# Altium schematic sheet Sheet2.SchDoc
size 839 x 594 mm; SheetNumber: 2; SheetTotal: 3
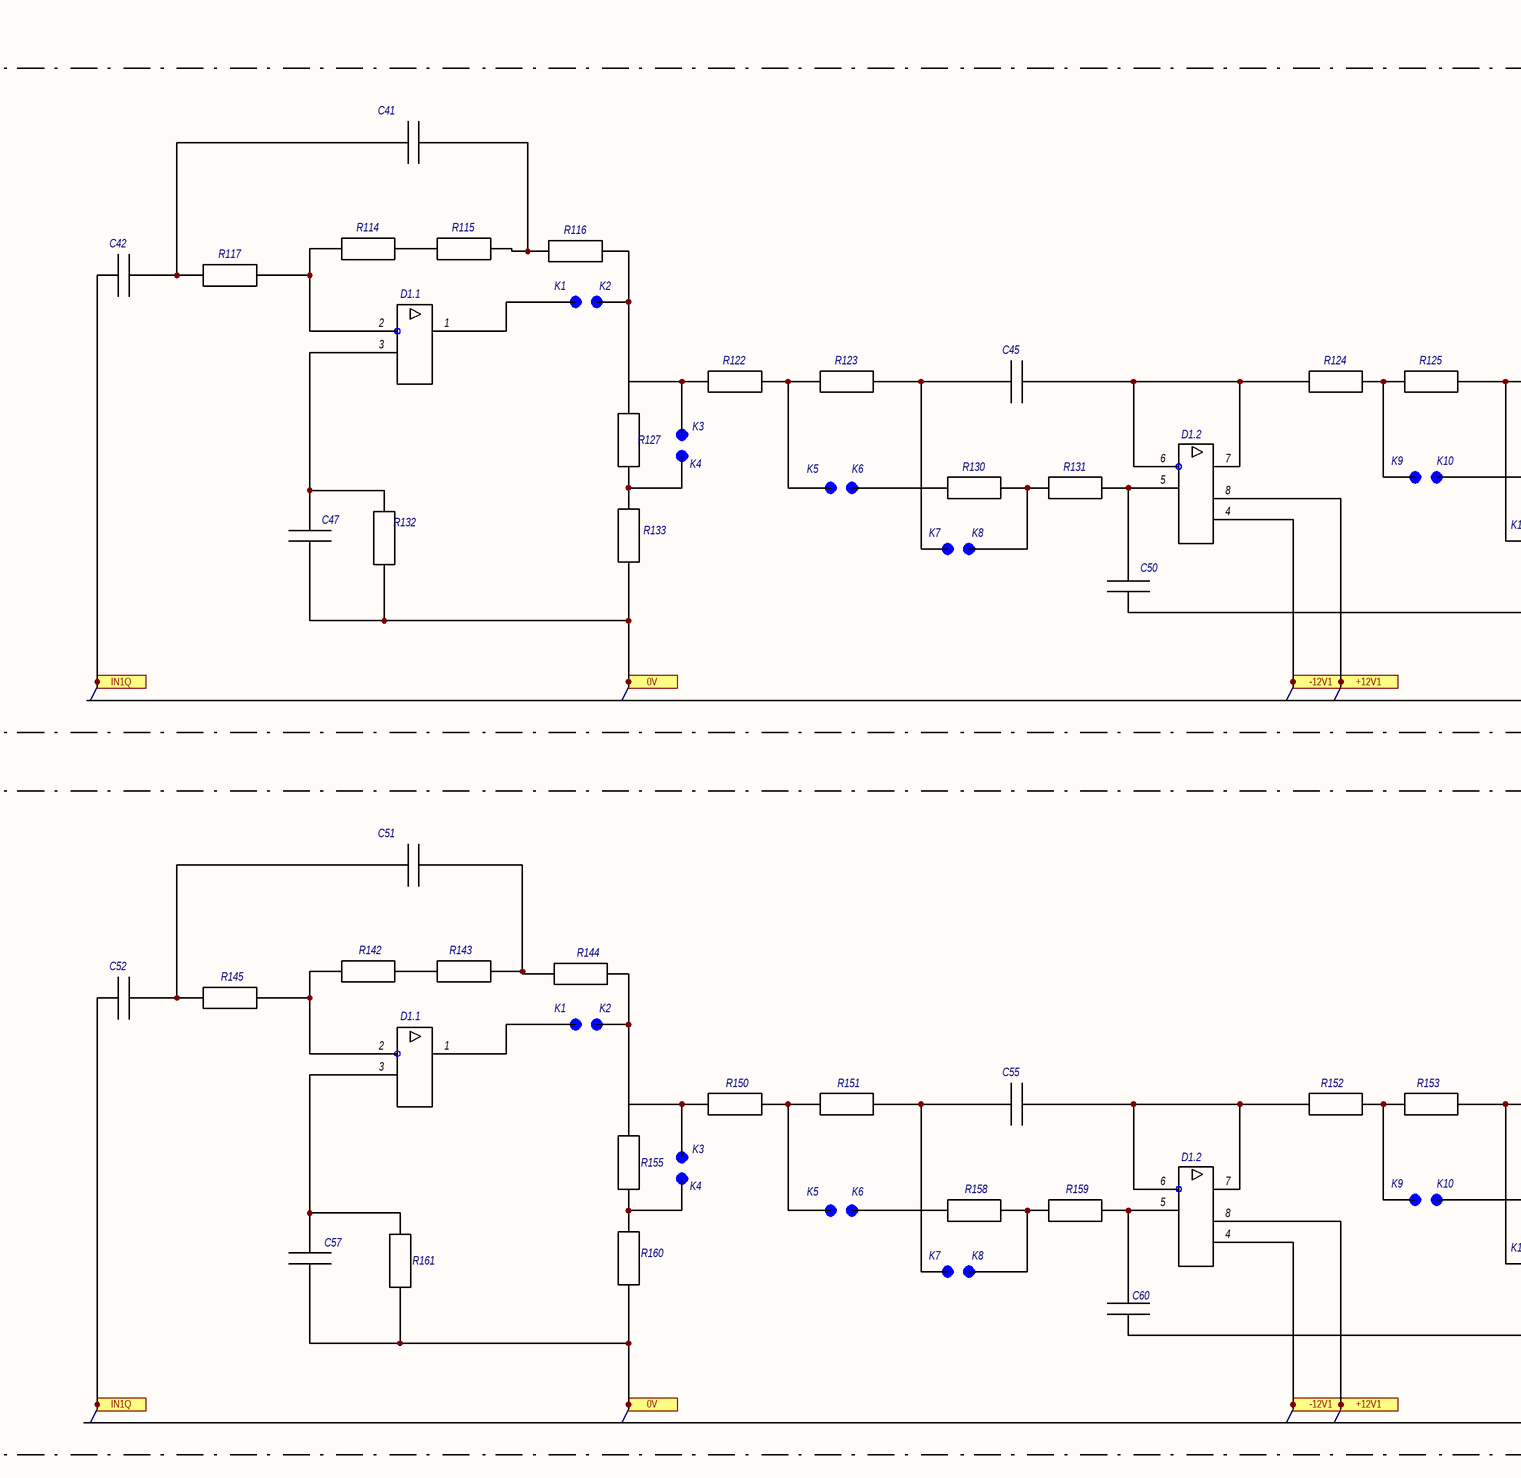
[diagram p0: Sheet2.SchDoc, top left]
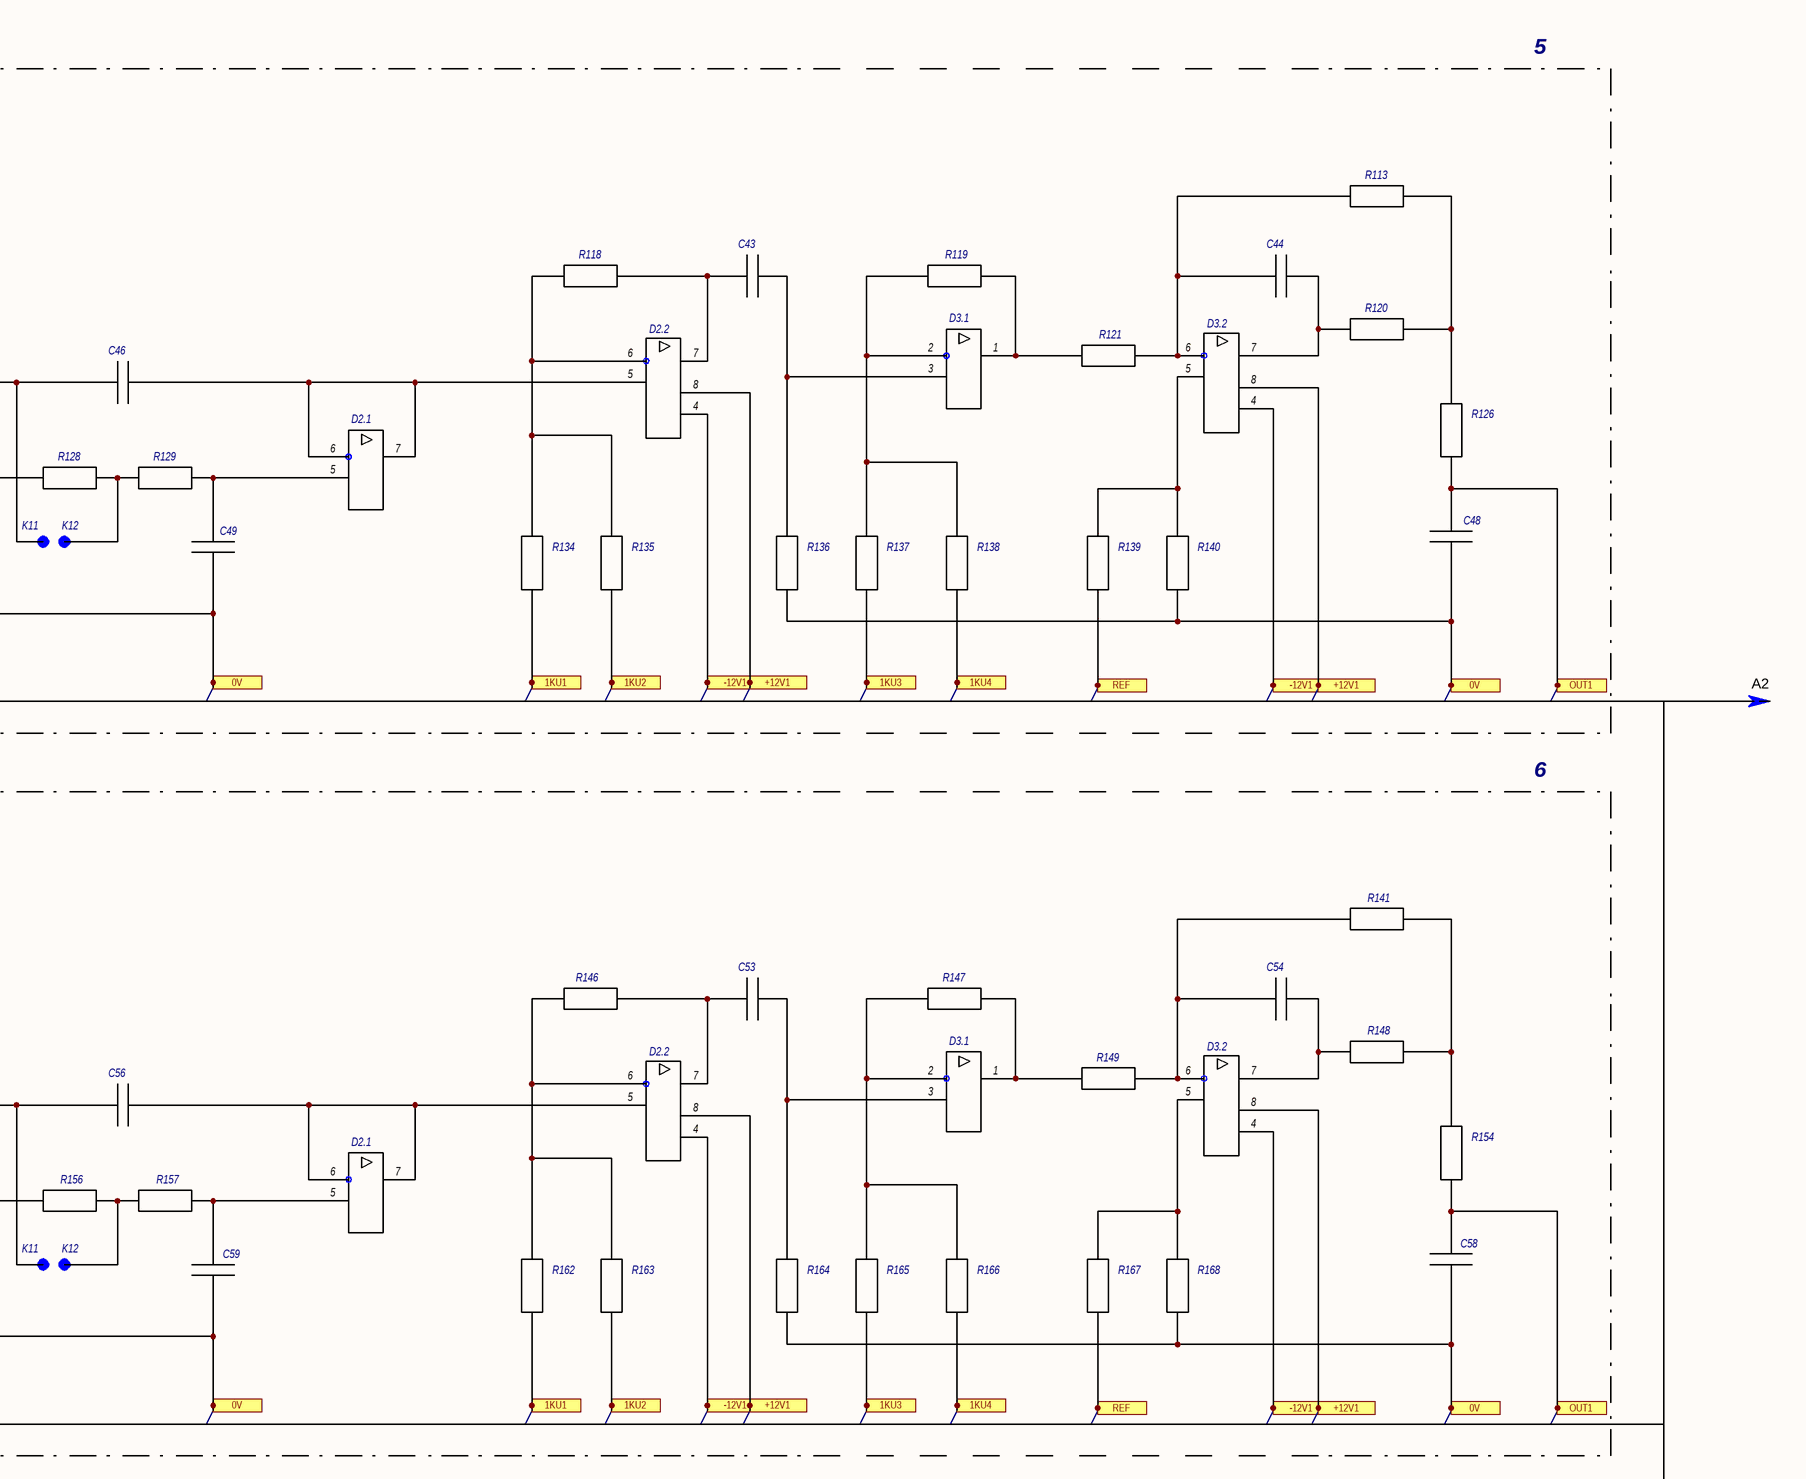
[diagram p1: Sheet2.SchDoc, top right]
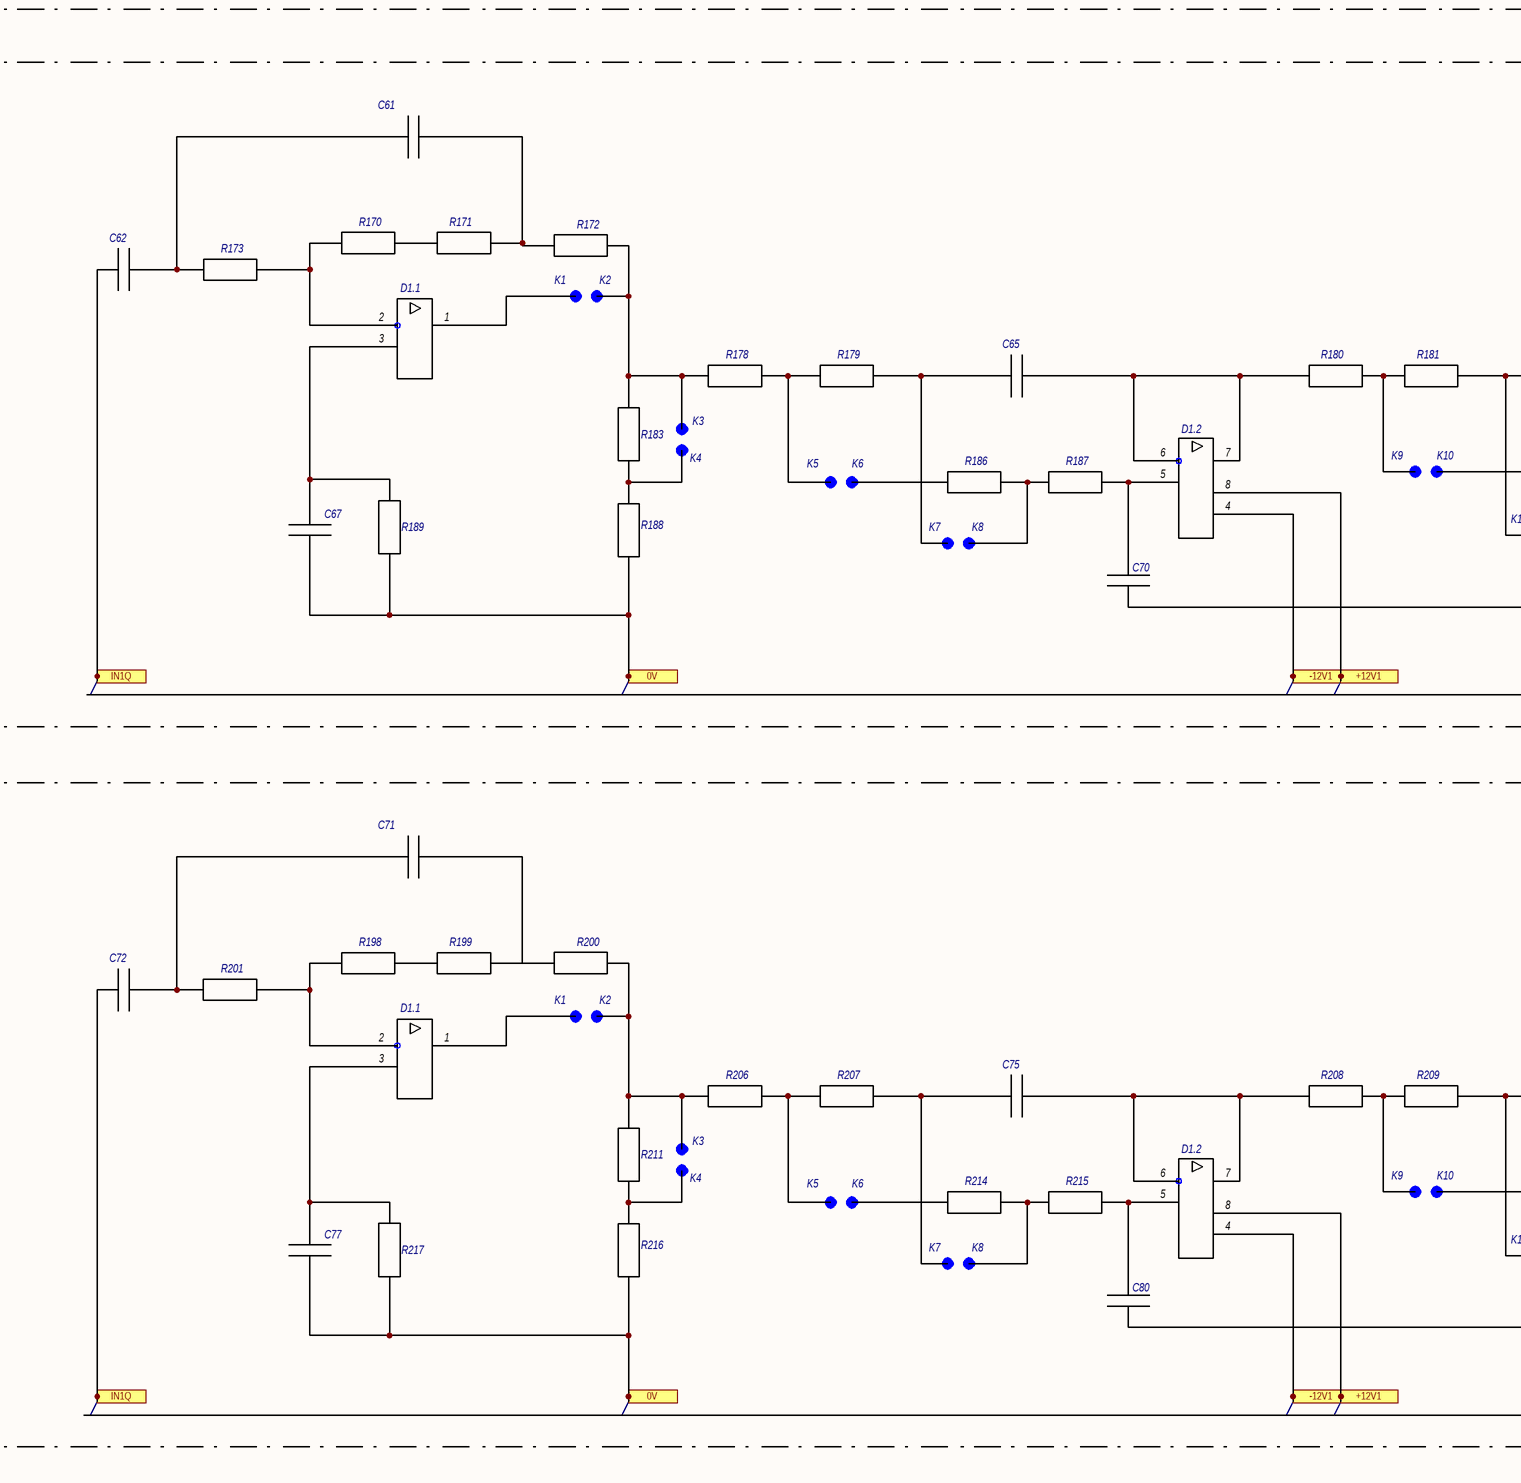
[diagram p2: Sheet2.SchDoc, bottom left]
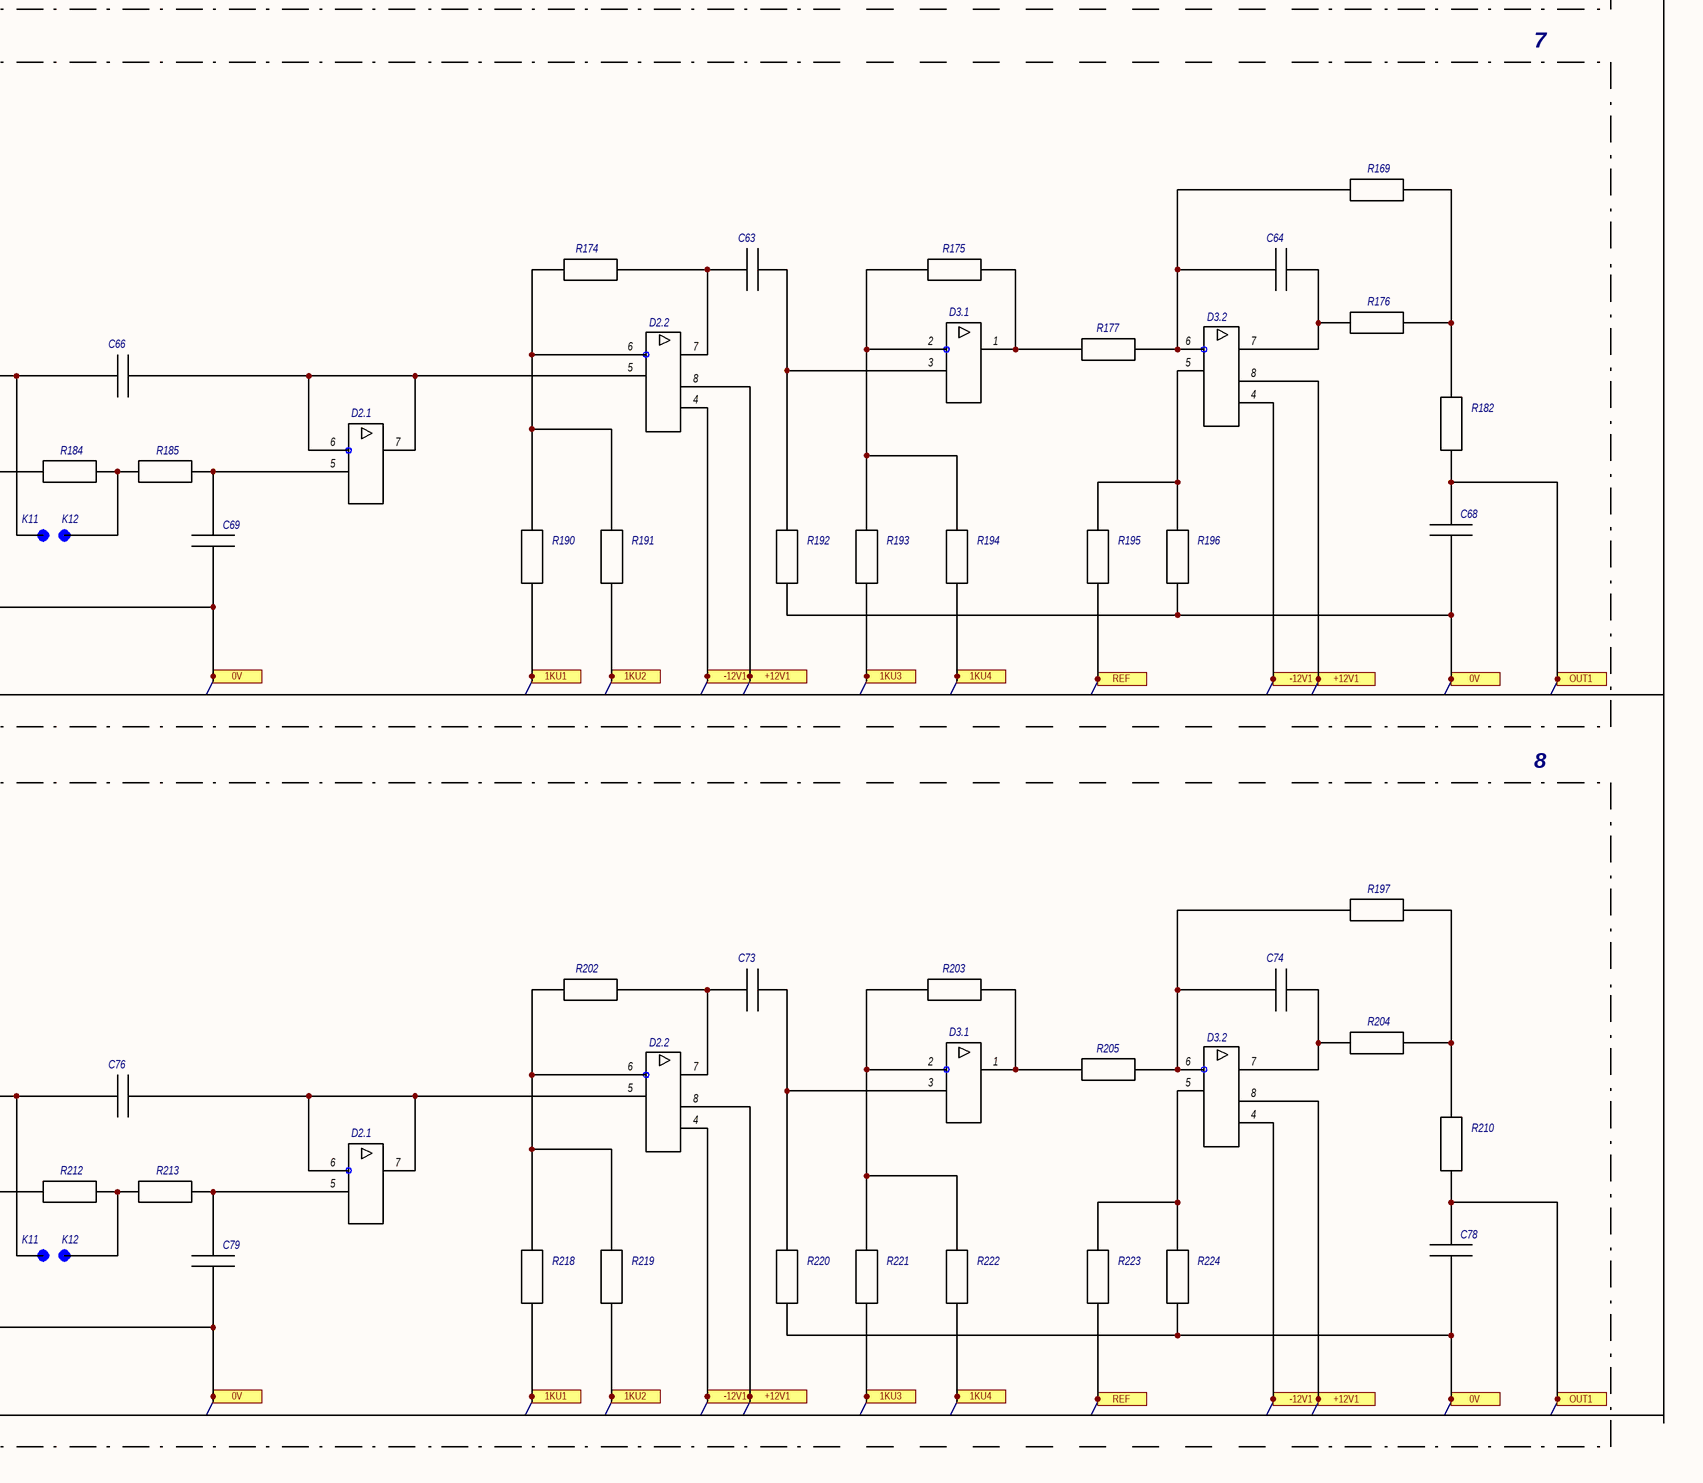
[diagram p3: Sheet2.SchDoc, bottom right]

## Parts
17  DA_AD822V1  [DD_TSOP8V1]  (value not drawn)  (parts A,B of 2)
18  DA_AD822V2  [DD_TSOP8V1]  (value not drawn)
19  DA_AD822V2  [DD_TSOP8V1]  (value not drawn)
20  DA_AD822V2  [DD_TSOP8V1]  (value not drawn)
21  DA_AD822V1  [DD_TSOP8V1]  (value not drawn)  (parts A,B of 2)
22  DA_AD822V2  [DD_TSOP8V1]  (value not drawn)
23  DA_AD822V2  [DD_TSOP8V1]  (value not drawn)
24  DA_AD822V2  [DD_TSOP8V1]  (value not drawn)
25  DA_AD822V1  [DD_TSOP8V1]  (value not drawn)  (parts A,B of 2)
26  DA_AD822V2  [DD_TSOP8V1]  (value not drawn)
27  DA_AD822V2  [DD_TSOP8V1]  (value not drawn)
28  DA_AD822V2  [DD_TSOP8V1]  (value not drawn)
29  DA_AD822V1  [DD_TSOP8V1]  (value not drawn)  (parts A,B of 2)
30  DA_AD822V2  [DD_TSOP8V1]  (value not drawn)
31  DA_AD822V2  [DD_TSOP8V1]  (value not drawn)
32  DA_AD822V2  [DD_TSOP8V1]  (value not drawn)
?  PWR_ARROW  (value not drawn)  (graphical)
C41  C_1210  [C_1210]  (value not drawn)
C42  C_0603  [C_0603]  (value not drawn)
C43  C_0603  [C_0603]  (value not drawn)
C44  C_0603  [C_0603]  (value not drawn)
C45  C_0603  [C_0603]  (value not drawn)
C46  C_0603  [C_0603]  (value not drawn)
C47  C_0603  [C_0603]  (value not drawn)
C48  C_0603  [C_0603]  (value not drawn)
C49  C_0603  [C_0603]  (value not drawn)
C50  C_0603  [C_0603]  (value not drawn)
C51  C_1210  [C_1210]  (value not drawn)
C52  C_0603  [C_0603]  (value not drawn)
C53  C_0603  [C_0603]  (value not drawn)
C54  C_0603  [C_0603]  (value not drawn)
C55  C_0603  [C_0603]  (value not drawn)
C56  C_0603  [C_0603]  (value not drawn)
C57  C_0603  [C_0603]  (value not drawn)
C58  C_0603  [C_0603]  (value not drawn)
C59  C_0603  [C_0603]  (value not drawn)
C60  C_0603  [C_0603]  (value not drawn)
C61  C_1210  [C_1210]  (value not drawn)
C62  C_0603  [C_0603]  (value not drawn)
C63  C_0603  [C_0603]  (value not drawn)
C64  C_0603  [C_0603]  (value not drawn)
C65  C_0603  [C_0603]  (value not drawn)
C66  C_0603  [C_0603]  (value not drawn)
C67  C_0603  [C_0603]  (value not drawn)
C68  C_0603  [C_0603]  (value not drawn)
C69  C_0603  [C_0603]  (value not drawn)
C70  C_0603  [C_0603]  (value not drawn)
C71  C_1210  [C_1210]  (value not drawn)
C72  C_0603  [C_0603]  (value not drawn)
C73  C_0603  [C_0603]  (value not drawn)
C74  C_0603  [C_0603]  (value not drawn)
C75  C_0603  [C_0603]  (value not drawn)
C76  C_0603  [C_0603]  (value not drawn)
C77  C_0603  [C_0603]  (value not drawn)
C78  C_0603  [C_0603]  (value not drawn)
C79  C_0603  [C_0603]  (value not drawn)
C80  C_0603  [C_0603]  (value not drawn)
D5  DA_AD822V1  [DD_TSOP8V1]  (value not drawn)  (part A of 2)
D6  DA_AD822V1  [DD_TSOP8V1]  (value not drawn)  (part A of 2)
D7  DA_AD822V1  [DD_TSOP8V1]  (value not drawn)  (part A of 2)
D8  DA_AD822V1  [DD_TSOP8V1]  (value not drawn)  (part A of 2)
JP25  X_JP-PCB1.4  [X_JP-PCB1.4]  (value not drawn)
JP26  X_JP-PCB1.4  [X_JP-PCB1.4]  (value not drawn)
JP27  X_JP-PCB1.4  [X_JP-PCB1.4]  (value not drawn)
JP28  X_JP-PCB1.4  [X_JP-PCB1.4]  (value not drawn)
JP29  X_JP-PCB1.4  [X_JP-PCB1.4]  (value not drawn)
JP30  X_JP-PCB1.4  [X_JP-PCB1.4]  (value not drawn)
JP31  X_JP-PCB1.4  [X_JP-PCB1.4]  (value not drawn)
JP32  X_JP-PCB1.4  [X_JP-PCB1.4]  (value not drawn)
JP33  X_JP-PCB1.4  [X_JP-PCB1.4]  (value not drawn)
JP34  X_JP-PCB1.4  [X_JP-PCB1.4]  (value not drawn)
JP35  X_JP-PCB1.4  [X_JP-PCB1.4]  (value not drawn)
JP36  X_JP-PCB1.4  [X_JP-PCB1.4]  (value not drawn)
JP37  X_JP-PCB1.4  [X_JP-PCB1.4]  (value not drawn)
JP38  X_JP-PCB1.4  [X_JP-PCB1.4]  (value not drawn)
JP39  X_JP-PCB1.4  [X_JP-PCB1.4]  (value not drawn)
JP40  X_JP-PCB1.4  [X_JP-PCB1.4]  (value not drawn)
JP41  X_JP-PCB1.4  [X_JP-PCB1.4]  (value not drawn)
JP42  X_JP-PCB1.4  [X_JP-PCB1.4]  (value not drawn)
JP43  X_JP-PCB1.4  [X_JP-PCB1.4]  (value not drawn)
JP44  X_JP-PCB1.4  [X_JP-PCB1.4]  (value not drawn)
JP45  X_JP-PCB1.4  [X_JP-PCB1.4]  (value not drawn)
JP46  X_JP-PCB1.4  [X_JP-PCB1.4]  (value not drawn)
JP47  X_JP-PCB1.4  [X_JP-PCB1.4]  (value not drawn)
JP48  X_JP-PCB1.4  [X_JP-PCB1.4]  (value not drawn)
R113  R_0603  [R_0603]  (value not drawn)
R114  R_0603  [R_0603]  (value not drawn)
R115  R_0603  [R_0603]  (value not drawn)
R116  R_0603  [R_0603]  (value not drawn)
R117  R_0603  [R_0603]  (value not drawn)
R118  R_0603  [R_0603]  (value not drawn)
R119  R_0603  [R_0603]  (value not drawn)
R120  R_0603  [R_0603]  (value not drawn)
R121  R_0603  [R_0603]  (value not drawn)
R122  R_0603  [R_0603]  (value not drawn)
R123  R_0603  [R_0603]  (value not drawn)
R124  R_0603  [R_0603]  (value not drawn)
R125  R_0603  [R_0603]  (value not drawn)
R126  R_0603  [R_0603]  (value not drawn)
R127  R_0603  [R_0603]  (value not drawn)
R128  R_0603  [R_0603]  (value not drawn)
R129  R_0603  [R_0603]  (value not drawn)
R130  R_0603  [R_0603]  (value not drawn)
R131  R_0603  [R_0603]  (value not drawn)
R132  R_0603  [R_0603]  (value not drawn)
R133  R_0603  [R_0603]  (value not drawn)
R134  R_0603  [R_0603]  (value not drawn)
R135  R_0603  [R_0603]  (value not drawn)
R136  R_0603  [R_0603]  (value not drawn)
R137  R_0603  [R_0603]  (value not drawn)
R138  R_0603  [R_0603]  (value not drawn)
R139  R_0603  [R_0603]  (value not drawn)
R140  R_0603  [R_0603]  (value not drawn)
R141  R_0603  [R_0603]  (value not drawn)
R142  R_0603  [R_0603]  (value not drawn)
R143  R_0603  [R_0603]  (value not drawn)
R144  R_0603  [R_0603]  (value not drawn)
R145  R_0603  [R_0603]  (value not drawn)
R146  R_0603  [R_0603]  (value not drawn)
R147  R_0603  [R_0603]  (value not drawn)
R148  R_0603  [R_0603]  (value not drawn)
R149  R_0603  [R_0603]  (value not drawn)
R150  R_0603  [R_0603]  (value not drawn)
R151  R_0603  [R_0603]  (value not drawn)
R152  R_0603  [R_0603]  (value not drawn)
R153  R_0603  [R_0603]  (value not drawn)
R154  R_0603  [R_0603]  (value not drawn)
R155  R_0603  [R_0603]  (value not drawn)
R156  R_0603  [R_0603]  (value not drawn)
R157  R_0603  [R_0603]  (value not drawn)
R158  R_0603  [R_0603]  (value not drawn)
R159  R_0603  [R_0603]  (value not drawn)
R160  R_0603  [R_0603]  (value not drawn)
R161  R_0603  [R_0603]  (value not drawn)
R162  R_0603  [R_0603]  (value not drawn)
R163  R_0603  [R_0603]  (value not drawn)
R164  R_0603  [R_0603]  (value not drawn)
R165  R_0603  [R_0603]  (value not drawn)
R166  R_0603  [R_0603]  (value not drawn)
R167  R_0603  [R_0603]  (value not drawn)
R168  R_0603  [R_0603]  (value not drawn)
R169  R_0603  [R_0603]  (value not drawn)
R170  R_0603  [R_0603]  (value not drawn)
R171  R_0603  [R_0603]  (value not drawn)
R172  R_0603  [R_0603]  (value not drawn)
R173  R_0603  [R_0603]  (value not drawn)
R174  R_0603  [R_0603]  (value not drawn)
R175  R_0603  [R_0603]  (value not drawn)
R176  R_0603  [R_0603]  (value not drawn)
R177  R_0603  [R_0603]  (value not drawn)
R178  R_0603  [R_0603]  (value not drawn)
R179  R_0603  [R_0603]  (value not drawn)
R180  R_0603  [R_0603]  (value not drawn)
R181  R_0603  [R_0603]  (value not drawn)
R182  R_0603  [R_0603]  (value not drawn)
R183  R_0603  [R_0603]  (value not drawn)
R184  R_0603  [R_0603]  (value not drawn)
R185  R_0603  [R_0603]  (value not drawn)
R186  R_0603  [R_0603]  (value not drawn)
R187  R_0603  [R_0603]  (value not drawn)
R188  R_0603  [R_0603]  (value not drawn)
R189  R_0603  [R_0603]  (value not drawn)
R190  R_0603  [R_0603]  (value not drawn)
R191  R_0603  [R_0603]  (value not drawn)
R192  R_0603  [R_0603]  (value not drawn)
R193  R_0603  [R_0603]  (value not drawn)
R194  R_0603  [R_0603]  (value not drawn)
R195  R_0603  [R_0603]  (value not drawn)
R196  R_0603  [R_0603]  (value not drawn)
R197  R_0603  [R_0603]  (value not drawn)
R198  R_0603  [R_0603]  (value not drawn)
R199  R_0603  [R_0603]  (value not drawn)
R200  R_0603  [R_0603]  (value not drawn)
R201  R_0603  [R_0603]  (value not drawn)
R202  R_0603  [R_0603]  (value not drawn)
R203  R_0603  [R_0603]  (value not drawn)
R204  R_0603  [R_0603]  (value not drawn)
R205  R_0603  [R_0603]  (value not drawn)
R206  R_0603  [R_0603]  (value not drawn)
R207  R_0603  [R_0603]  (value not drawn)
R208  R_0603  [R_0603]  (value not drawn)
R209  R_0603  [R_0603]  (value not drawn)
R210  R_0603  [R_0603]  (value not drawn)
R211  R_0603  [R_0603]  (value not drawn)
R212  R_0603  [R_0603]  (value not drawn)
R213  R_0603  [R_0603]  (value not drawn)
R214  R_0603  [R_0603]  (value not drawn)
R215  R_0603  [R_0603]  (value not drawn)
R216  R_0603  [R_0603]  (value not drawn)
R217  R_0603  [R_0603]  (value not drawn)
R218  R_0603  [R_0603]  (value not drawn)
R219  R_0603  [R_0603]  (value not drawn)
R220  R_0603  [R_0603]  (value not drawn)
R221  R_0603  [R_0603]  (value not drawn)
R222  R_0603  [R_0603]  (value not drawn)
R223  R_0603  [R_0603]  (value not drawn)
R224  R_0603  [R_0603]  (value not drawn)

## Ports
0V, 1KU1, 1KU2, 1KU3, 1KU4, +12V1, -12V1, IN1Q, OUT1, REF

## Nets
+VA: 17.4(+VA) 17.8(+VA) 21.4(+VA) 21.8(+VA) 25.4(+VA) 25.8(+VA) 29.4(+VA) 29.8(+VA) D5.4(+VA) D5.8(+VA) D6.4(+VA) D6.8(+VA) D7.4(+VA) D7.8(+VA) D8.4(+VA) D8.8(+VA)
0V: C47.2 C48.1 C49.2 C50.2 C57.2 C58.1 C59.2 C60.2 C67.2 C68.1 C69.2 C70.2 C77.2 C78.1 C79.2 C80.2 R132.1 R133.1 R136.2 R140.2 R160.1 R161.1 R164.2 R168.2 R188.1 R189.1 R192.2 R196.2 R216.1 R217.1 R220.2 R224.2 ; port 0V
1KU1: R134.2 R162.2 R190.2 R218.2 ; port 1KU1
1KU2: R135.2 R163.2 R191.2 R219.2 ; port 1KU2
1KU3: R137.2 R165.2 R193.2 R221.2 ; port 1KU3
1KU4: R138.2 R166.2 R194.2 R222.2 ; port 1KU4
+12V1: 18.8 19.8 20.8 22.8 23.8 24.8 26.8 27.8 28.8 30.8 31.8 32.8 ; port +12V1
-12V1: 18.4 19.4 20.4 22.4 23.4 24.4 26.4 27.4 28.4 30.4 31.4 32.4 ; port -12V1
IN1Q: C42.1 C52.1 C62.1 C72.1 ; port IN1Q
OUT1: C48.2 C58.2 C68.2 C78.2 R126.2 R154.2 R182.2 R210.2 ; port OUT1
REF: R139.2 R167.2 R195.2 R223.2 ; port REF
Net17_1: 17.1 R119.1 R121.2
Net17_2: 17.2 R119.2 R137.1 R138.1
Net17_3: 17.3 C43.2 R136.1
Net17_5: 17.5 C49.1 R129.1
Net17_6: 17.6 17.7 19.5 C46.2
Net18_5: 18.5 R139.1 R140.1
Net18_6: 18.6 C44.1 R113.2 R121.1
Net18_7: 18.7 C44.2 R120.2
Net19_6: 19.6 R118.2 R134.1 R135.1
Net19_7: 19.7 C43.1 R118.1
Net20_5: 20.5 C50.1 R131.1
Net20_6: 20.6 20.7 C45.2 R124.2
Net21_1: 21.1 R147.1 R149.2
Net21_2: 21.2 R147.2 R165.1 R166.1
Net21_3: 21.3 C53.2 R164.1
Net21_5: 21.5 C59.1 R157.1
Net21_6: 21.6 21.7 23.5 C56.2
Net22_5: 22.5 R167.1 R168.1
Net22_6: 22.6 C54.1 R141.2 R149.1
Net22_7: 22.7 C54.2 R148.2
Net23_6: 23.6 R146.2 R162.1 R163.1
Net23_7: 23.7 C53.1 R146.1
Net24_5: 24.5 C60.1 R159.1
Net24_6: 24.6 24.7 C55.2 R152.2
Net25_1: 25.1 R175.1 R177.2
Net25_2: 25.2 R175.2 R193.1 R194.1
Net25_3: 25.3 C63.2 R192.1
Net25_5: 25.5 C69.1 R185.1
Net25_6: 25.6 25.7 27.5 C66.2
Net26_5: 26.5 R195.1 R196.1
Net26_6: 26.6 C64.1 R169.2 R177.1
Net26_7: 26.7 C64.2 R176.2
Net27_6: 27.6 R174.2 R190.1 R191.1
Net27_7: 27.7 C63.1 R174.1
Net28_5: 28.5 C70.1 R187.1
Net28_6: 28.6 28.7 C65.2 R180.2
Net29_1: 29.1 R203.1 R205.2
Net29_2: 29.2 R203.2 R221.1 R222.1
Net29_3: 29.3 C73.2 R220.1
Net29_5: 29.5 C79.1 R213.1
Net29_6: 29.6 29.7 31.5 C76.2
Net30_5: 30.5 R223.1 R224.1
Net30_6: 30.6 C74.1 R197.2 R205.1
Net30_7: 30.7 C74.2 R204.2
Net31_6: 31.6 R202.2 R218.1 R219.1
Net31_7: 31.7 C73.1 R202.1
Net32_5: 32.5 C80.1 R215.1
Net32_6: 32.6 32.7 C75.2 R208.2
NetC41_1: C41.1 R115.1 R116.2
NetC41_2: C41.2 C42.2 R117.2
NetC45_1: C45.1 JP30.1 R123.1
NetC46_1: C46.1 JP29.1 R125.1
NetC47_1: C47.1 D5.3 R132.2
NetC51_1: C51.1 R143.1 R144.2
NetC51_2: C51.2 C52.2 R145.2
NetC55_1: C55.1 JP36.1 R151.1
NetC56_1: C56.1 JP35.1 R153.1
NetC57_1: C57.1 D6.3 R161.2
NetC61_1: C61.1 R171.1 R172.2
NetC61_2: C61.2 C62.2 R173.2
NetC65_1: C65.1 JP42.1 R179.1
NetC66_1: C66.1 JP41.1 R181.1
NetC67_1: C67.1 D7.3 R189.2
NetC71_1: C71.1 R199.1 R200.2
NetC71_2: C71.2 C72.2 R201.2
NetC75_1: C75.1 JP48.1 R207.1
NetC76_1: C76.1 JP47.1 R209.1
NetC77_1: C77.1 D8.3 R217.2
NetD5_1: D5.1 JP25.1
NetD5_2: D5.2 R114.2 R117.1
NetD6_1: D6.1 JP31.1
NetD6_2: D6.2 R142.2 R145.1
NetD7_1: D7.1 JP37.1
NetD7_2: D7.2 R170.2 R173.1
NetD8_1: D8.1 JP43.1
NetD8_2: D8.2 R198.2 R201.1
NetJP25_2: JP25.2 JP26.1 R116.1 R122.2 R127.2
NetJP26_2: JP26.2 R127.1 R133.2
NetJP27_1: JP27.1 R124.1 R125.2
NetJP27_2: JP27.2 R128.2
NetJP28_1: JP28.1 R122.1 R123.2
NetJP28_2: JP28.2 R130.2
NetJP29_2: JP29.2 R128.1 R129.2
NetJP30_2: JP30.2 R130.1 R131.2
NetJP31_2: JP31.2 JP32.1 R144.1 R150.2 R155.2
NetJP32_2: JP32.2 R155.1 R160.2
NetJP33_1: JP33.1 R152.1 R153.2
NetJP33_2: JP33.2 R156.2
NetJP34_1: JP34.1 R150.1 R151.2
NetJP34_2: JP34.2 R158.2
NetJP35_2: JP35.2 R156.1 R157.2
NetJP36_2: JP36.2 R158.1 R159.2
NetJP37_2: JP37.2 JP38.1 R172.1 R178.2 R183.2
NetJP38_2: JP38.2 R183.1 R188.2
NetJP39_1: JP39.1 R180.1 R181.2
NetJP39_2: JP39.2 R184.2
NetJP40_1: JP40.1 R178.1 R179.2
NetJP40_2: JP40.2 R186.2
NetJP41_2: JP41.2 R184.1 R185.2
NetJP42_2: JP42.2 R186.1 R187.2
NetJP43_2: JP43.2 JP44.1 R200.1 R206.2 R211.2
NetJP44_2: JP44.2 R211.1 R216.2
NetJP45_1: JP45.1 R208.1 R209.2
NetJP45_2: JP45.2 R212.2
NetJP46_1: JP46.1 R206.1 R207.2
NetJP46_2: JP46.2 R214.2
NetJP47_2: JP47.2 R212.1 R213.2
NetJP48_2: JP48.2 R214.1 R215.2
NetR113_1: R113.1 R120.1 R126.1
NetR114_1: R114.1 R115.2
NetR141_1: R141.1 R148.1 R154.1
NetR142_1: R142.1 R143.2
NetR169_1: R169.1 R176.1 R182.1
NetR170_1: R170.1 R171.2
NetR197_1: R197.1 R204.1 R210.1
NetR198_1: R198.1 R199.2

Not connected (* = marked no-connect by the designer): ? 1

## Notes on the sheet
- 5
- D1.1
- (near JP25) K1
- (near JP25) K2
- (near 19) D2.2
- D3.1
- (near 18) D3.2
- (near JP26) K3
- (near 20) D1.2
- (near 17) D2.1
- (near JP26) K4
- (near JP28) K5
- (near JP28) K6
- (near JP27) K9
- (near JP27) K10
- (near JP30) K7
- (near JP30) K8
- (near JP29) K11
- (near JP29) K12
- (near ?) A2
- 6
- (near JP31) K1
- (near JP31) K2
- (near 22) D3.2
- (near 23) D2.2
- (near JP32) K3
- (near 24) D1.2
- (near 21) D2.1
- (near JP32) K4
- (near JP34) K5
- (near JP34) K6
- (near JP33) K9
- (near JP33) K10
- (near JP35) K11
- (near JP35) K12
- (near JP36) K7
- (near JP36) K8
- 7
- (near JP37) K1
- (near JP37) K2
- (near 27) D2.2
- (near 26) D3.2
- (near JP38) K4
- (near JP38) K3
- (near JP40) K5
- (near JP40) K6
- (near 28) D1.2
- (near JP39) K9
- (near JP39) K10
- (near 25) D2.1
- (near JP42) K7
- (near JP42) K8
- (near JP41) K11
- (near JP41) K12
- 8
- (near JP43) K1
- (near JP43) K2
- (near 31) D2.2
- (near 30) D3.2
- (near JP44) K3
- (near 32) D1.2
- (near 29) D2.1
- (near JP44) K4
- (near JP46) K5
- (near JP46) K6
- (near JP45) K9
- (near JP45) K10
- (near JP48) K7
- (near JP48) K8
- (near JP47) K11
- (near JP47) K12
- Подп. и дата
- Инв.№ дубл.
- Взам.инв.№
- Подп.и дата
- Инв.№ подл.
- Изм.
- Лист
- № докум.
- Подп.
- Дата
- Формат  A1

## Library data of the parts
17 21 25 29 D5-D8 = DA_AD822V1: Value: AD822
18-20 22-24 26-28 30-32 = DA_AD822V2: Value: AD822
C41 C51 C61 C71 = C_1210: Value: 4020 1%
C42 C52 C62 C72 = C_0603: 0805; Value: 0,47; Mark: 0,01
C43 C53 C63 C73 = C_0603: 0805; Value: 0,15; Mark: 0,01
C44 C54 C64 C74 = C_0603: 0805; Value: 51pF; Mark: 0,01
C45 C46 C55 C56 C65 C66 C75 C76 = C_0603: 0805; Value: 0,0047; Mark: 0,01
C47 C57 C67 C77 = C_0603: 0805; Value: 0,033; Mark: 0,01
C48 C58 C68 C78 = C_0603: 0805; Value: 0,003; Mark: 0,01
C49 C59 C69 C79 = C_0603: 0805; Value: 0,0024; Mark: 0,01
C50 C60 C70 C80 = C_0603: 0805; Value: 0,00013; Mark: 0,01
R113 R119 R121 R134 R139-R141 R147 R149 R162 R167-R169 R175 R177 R190 R195-R197 R203 R205 R218 R223 R224 = R_0603: Value: 30,1к
R114 R117 R132 R142 R145 R161 R170 R173 R189 R198 R201 R217 = R_0603: Value: 200к
R115 R133 R143 R160 R171 R188 R199 R216 = R_0603: Value: 4,02к
R116 R144 R172 R200 = R_0603: Value: 40,2к
R118 R146 R174 R202 = R_0603: Value: 30.1к
R120 R148 R176 R204 = R_0603: Value: 100
R122 R131 R150 R159 R178 R187 R206 R215 = R_0603: Value: 84,5к
R123 R130 R151 R158 R179 R186 R207 R214 = R_0603: Value: 6,19к
R124 R129 R152 R157 R180 R185 R208 R213 = R_0603: Value: 34,8к
R125 R128 R153 R156 R181 R184 R209 R212 = R_0603: Value: 3,32к
R126 R154 R182 R210 = R_0603: Value: 511
R127 R155 R183 R211 = R_0603: Value: 1к
R135 R163 R191 R219 = R_0603: Value: 10к
R136 R164 R192 R220 = R_0603: Value: 154к
R137 R165 R193 R221 = R_0603: Value: 4,27к
R138 R166 R194 R222 = R_0603: Value: 976
JP25-JP48 = X_JP-PCB1.4: Value: *